# Altium schematic sheet Voeding.SchDoc
size A4; SheetNumber: 2; SheetTotal: 5
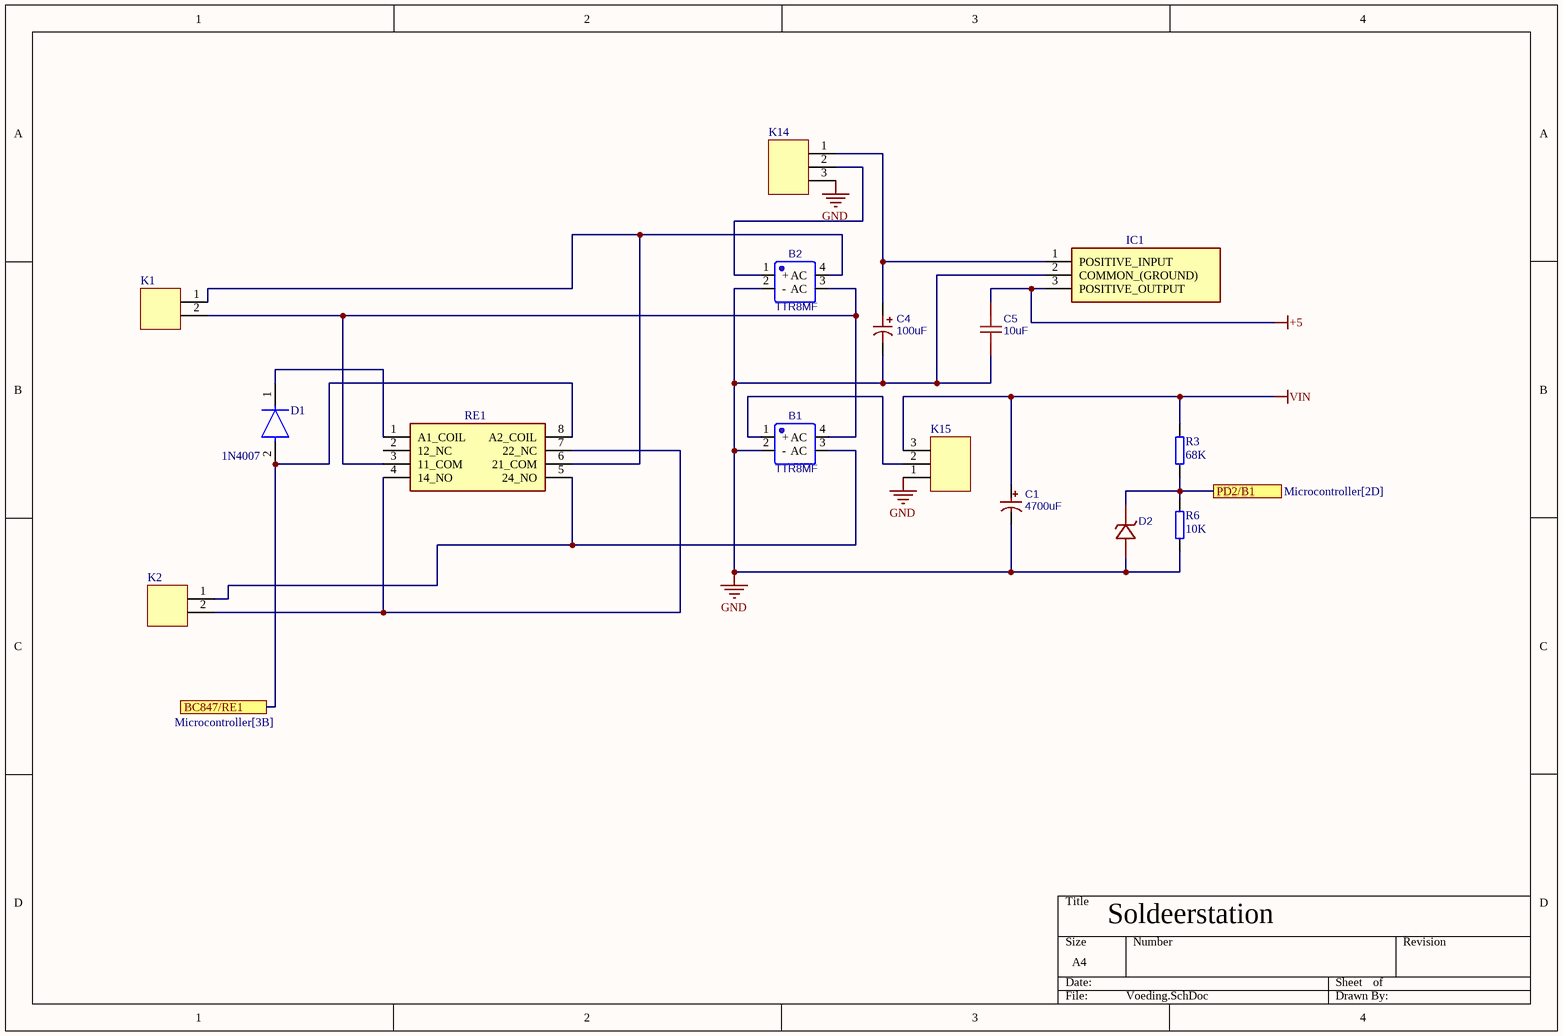
[diagram p0: Voeding.SchDoc]

## Parts
B1  TTR8MF  [B1,2 Brug gelijkrichter]
B2  TTR8MF  [B1,2 Brug gelijkrichter]
C1  4700uF  [C1 4700uF]
C4  100uF  [C4 100uF]
C5  10uF  [C2,5,10 10uF]
D1  1N4007  [FP-1N4007-MFG]
D2  (no value)  [D2 zener diode]
IC1  (no value)  [IC1 DC-DC converter]
K1  (no value)  [Terminal_2]
K2  (no value)  [Terminal_2]
K14  (no value)  [PInHeader_3]
K15  (no value)  [PInHeader_3]
R3  68K  [RESC2013X50X30ML20T20]
R6  10K  [RESC2013X50X30ML20T20]
RE1  (no value)  [RE1 Vermogen relais]

## Ports
BC847/RE1 (see Microcontroller[3B]), PD2/B1 (see Microcontroller[2D])

## Nets
+5: C5.2 IC1.3(POSITIVE_OUTPUT)
GND: B1.2(-) B2.2(-) C1.2 C4.2 C5.1 D2.2(A) IC1.2(COMMON_(GROUND)) K14.3 K15.1 R6.1
VIN: C1.1 K15.3 R3.2
BC847/RE1: D1.2(A) RE1.8(A2_COIL) ; port BC847/RE1
PD2/B1: D2.1(K) R3.1 R6.2 ; port PD2/B1
NetB1_1: B1.1(+) K15.2
NetB1_3: B1.3(AC) K2.1 RE1.5(24_NO)
NetB1_4: B1.4(AC) B2.3(AC) K1.2 RE1.3(11_COM)
NetB2_1: B2.1(+) K14.2
NetB2_4: B2.4(AC) K1.1 RE1.6(21_COM)
NetC4_1: C4.1 IC1.1(POSITIVE_INPUT) K14.1
NetD1_1: D1.1(C) RE1.1(A1_COIL)
NetK2_2: K2.2 RE1.4(14_NO) RE1.7(22_NC)

Not connected (* = marked no-connect by the designer): RE1 2(12_NC)

## Notes on the sheet
- Soldeerstation

## Library data of the parts
B1 B2 = B1,2 Brug Gelijkrichter: BOM_Manufacturer: MDD; Contributor: LCSC; BOM_Supplier: LCSC; BOM_Supplier Part: C712546; BOM_Manufacturer Part: TTR8MF; BOM_JLCPCB Part Class: Extended Part; spicePre: D; spiceSymbolName: TTR8MF
C1 = C1 4700uF: BOM_Manufacturer: CX(承兴); BOM_Manufacturer Part: KM478M050N35RR0VH2FP0; nameAlias: Capacitance; BOM_Supplier: LCSC; BOM_Supplier Part: C45662; BOM_JLCPCB Part Class: Extended Part; spicePre: C; spiceSymbolName: 4700uF 50V 22*35
C4 = C4 100uF: BOM_Manufacturer: Nichicon(尼吉康); BOM_Manufacturer Part: UWT1H101MNL1GS; Contributor: LCSC; nameAlias: Capacitance; BOM_Supplier: LCSC; BOM_Supplier Part: C445063; BOM_JLCPCB Part Class: Extended Part; spicePre: C; spiceSymbolName: UWT1H101MNL1GS
C5 = C2,5,10 10uF: BOM_Manufacturer: muRata(村田); BOM_Manufacturer Part: GRM21BR61H106KE43L; nameAlias: Capacitance; Contributor: LCSC; BOM_Supplier: LCSC; BOM_Supplier Part: C440198; BOM_JLCPCB Part Class: Basic Part; spicePre: C; spiceSymbolName: GRM21BR61H106KE43L
D1 = zo_1N4007: DIODE GEN PURP 1KV 1A DO204AL; Manufacturer: Vishay; Manufacturer Part Number: 1N4007-E3/54; Value: 15pF; Max Junction Temp: +150°C; Max Surge Forward Current: 30A; Max Repetitive Reverse Voltage: 1000V; Peak Reverse Current: 30uA; Octopart: https://octopart.com/1n4007-e3%2F54-vishay-39548207; Digikey Description: DIODE GEN PURP 1KV 1A DO204AL; Category: Diode; Mouser Description: Rectifiers Vr/1000V Io/1A; Automotive: No; Package: 1N4007; Device Class L3: Rectifier Diodes; Temperature Range High: +150°C; Capacitance: 15pF; Ipc Land Pattern Name: DIOPA1088W105L520D270; Lead Free: Yes; ComponentLink2Description: Datasheet; Forward Current: 1A; Device Class L1: Discrete Semiconductors; ComponentLink2URL: http://www.vishay.com/docs/88503/1n4001.pdf; Temperature Range Low: -50°C; Height: 2.7mm; RoHS: TRUE; Temperature: -50°C to +150°C; Device Class L2: Diodes
D2 = D2 zener diode: BZT52C5V1_C1884555; BOM_Manufacturer: YFW(佑风微); Contributor: LCSC; BOM_Supplier: LCSC; BOM_Supplier Part: C1884555; BOM_Manufacturer Part: BZT52C5V1; BOM_JLCPCB Part Class: Extended Part; spicePre: D; spiceSymbolName: BZT52C5V1_C1884555
IC1 = IC1 OKI-78SR-5_1.5-W36-C: Non-Isolated DC/DC Converters 7.5W 24Vin 5Vout1 1.5A SIP Non-Iso; Manufacturer_Name: Murata Electronics; Manufacturer_Part_Number: OKI-78SR-5/1.5-W36-C; Geometry.Height: 16.5mm; Mouser Part Number: 580-OKI78SR5/1.5W36C; Mouser Price/Stock: https://www.mouser.co.uk/ProductDetail/Murata-Power-Solutions/OKI-78SR-5-1.5-W36-C?qs=uJpRT2lXVNXJP%252Bo08dQqJQ%3D%3D; Datasheet Link: https://www.murata.com/products/productdata/8807037992990/oki-78sr.pdf?1583754815000
K1 K2 = K Terminal_2
K14 K15 = K PinHeader_3
R3 R6 = R Resistor: Manufacturer: Vishay Dale; Part Number: CRCW08050000Z0EA
RE1 = RE1 Vermogen relais: RT424005F  General Purpose Relays DPDT 8A 5VDC GEN PURPOSE RELAY; Manufacturer_Name: TE Connectivity; Mouser Part Number: 655-RT424005F; Mouser Price/Stock: https://www.mouser.co.uk/ProductDetail/TE-Connectivity-PB/RT424005F?qs=8wHch9UpSvaH%252B%252BmsSCbj0Q%3D%3D; Manufacturer_Part_Number: RT424005F; Datasheet Link: https://datasheet.datasheetarchive.com/originals/distributors/Datasheets_SAMA/2ef22a7a34dcc6453ddb52063c55ccaa.pdf